# Altium schematic sheet light.SchDoc
size A0; Revision: V 1.0
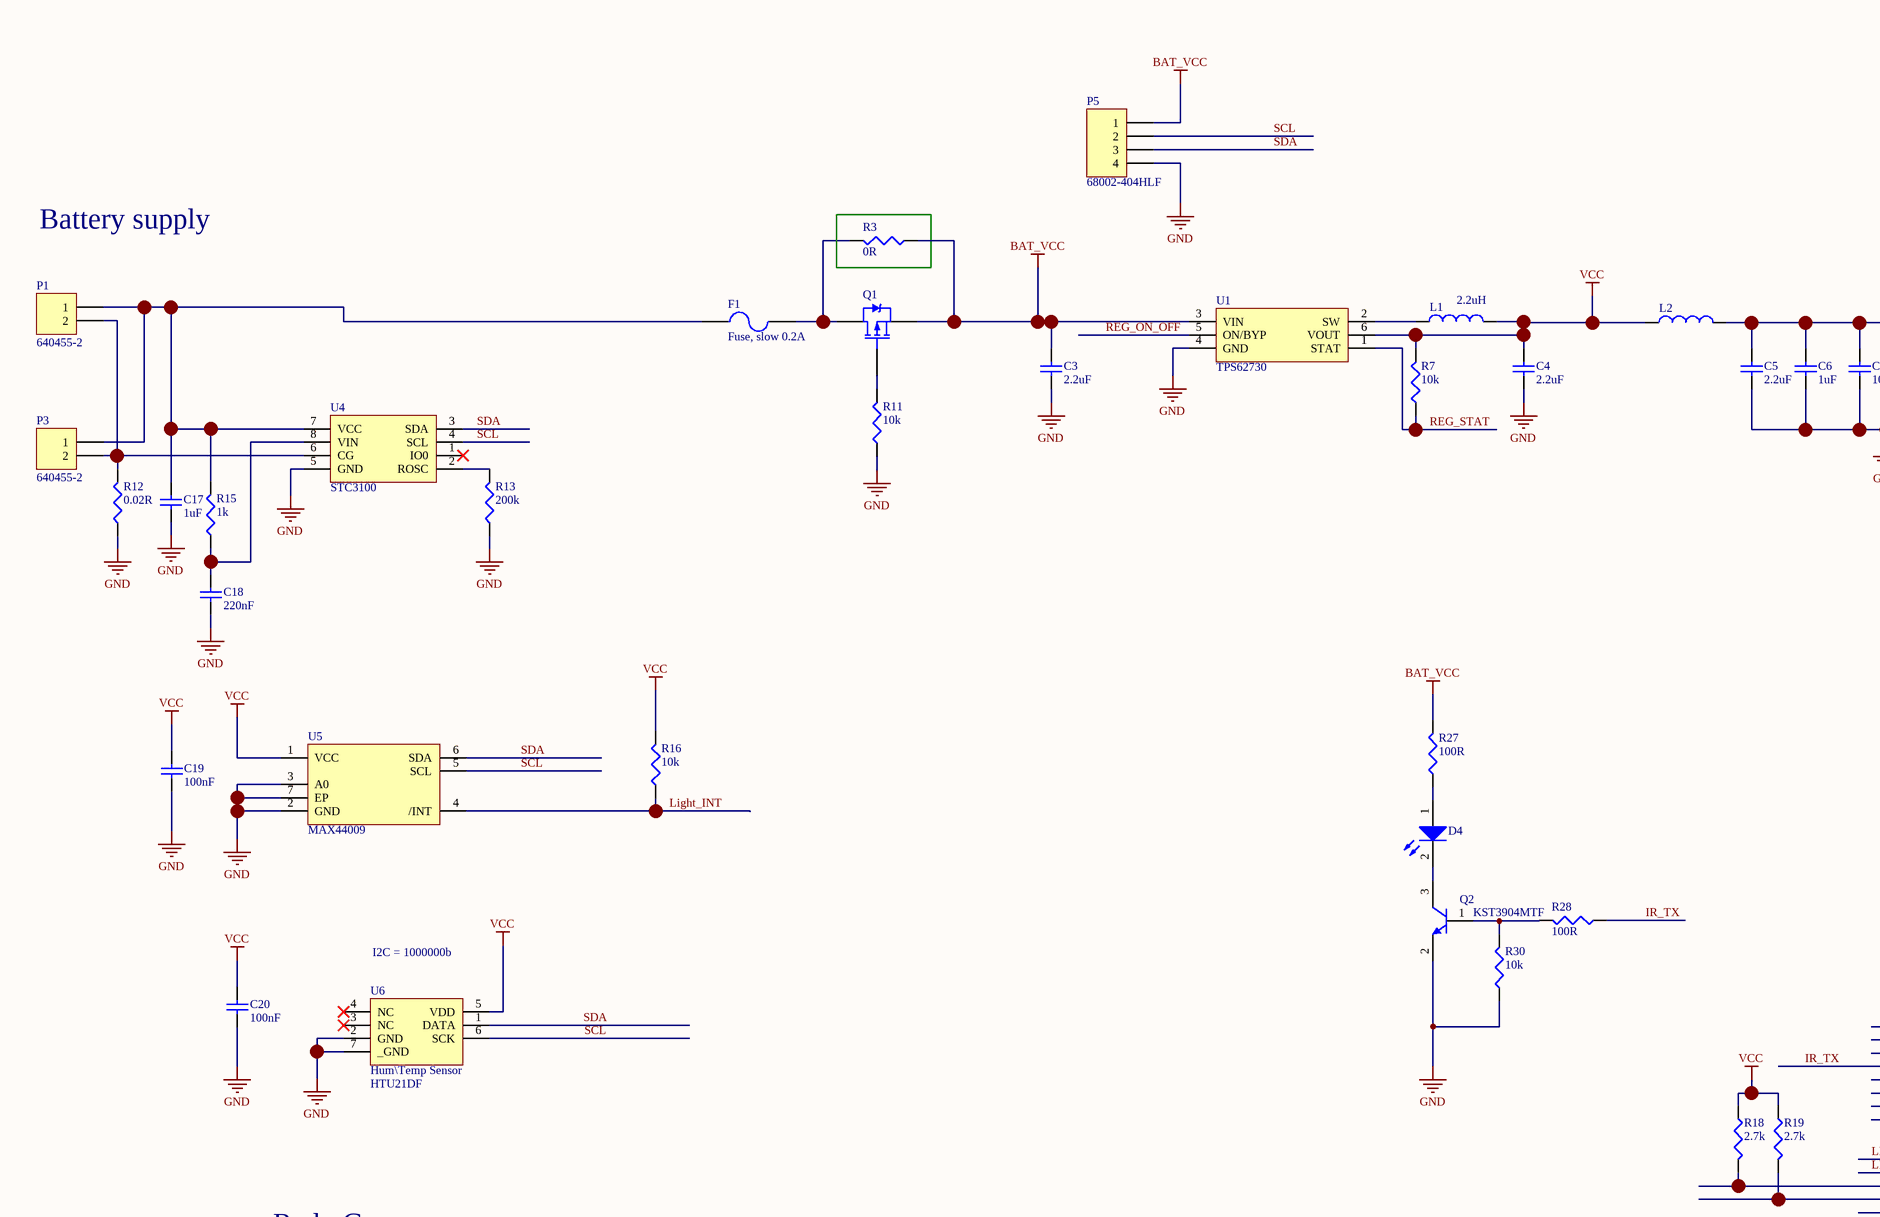
[diagram p0: light.SchDoc, top left]
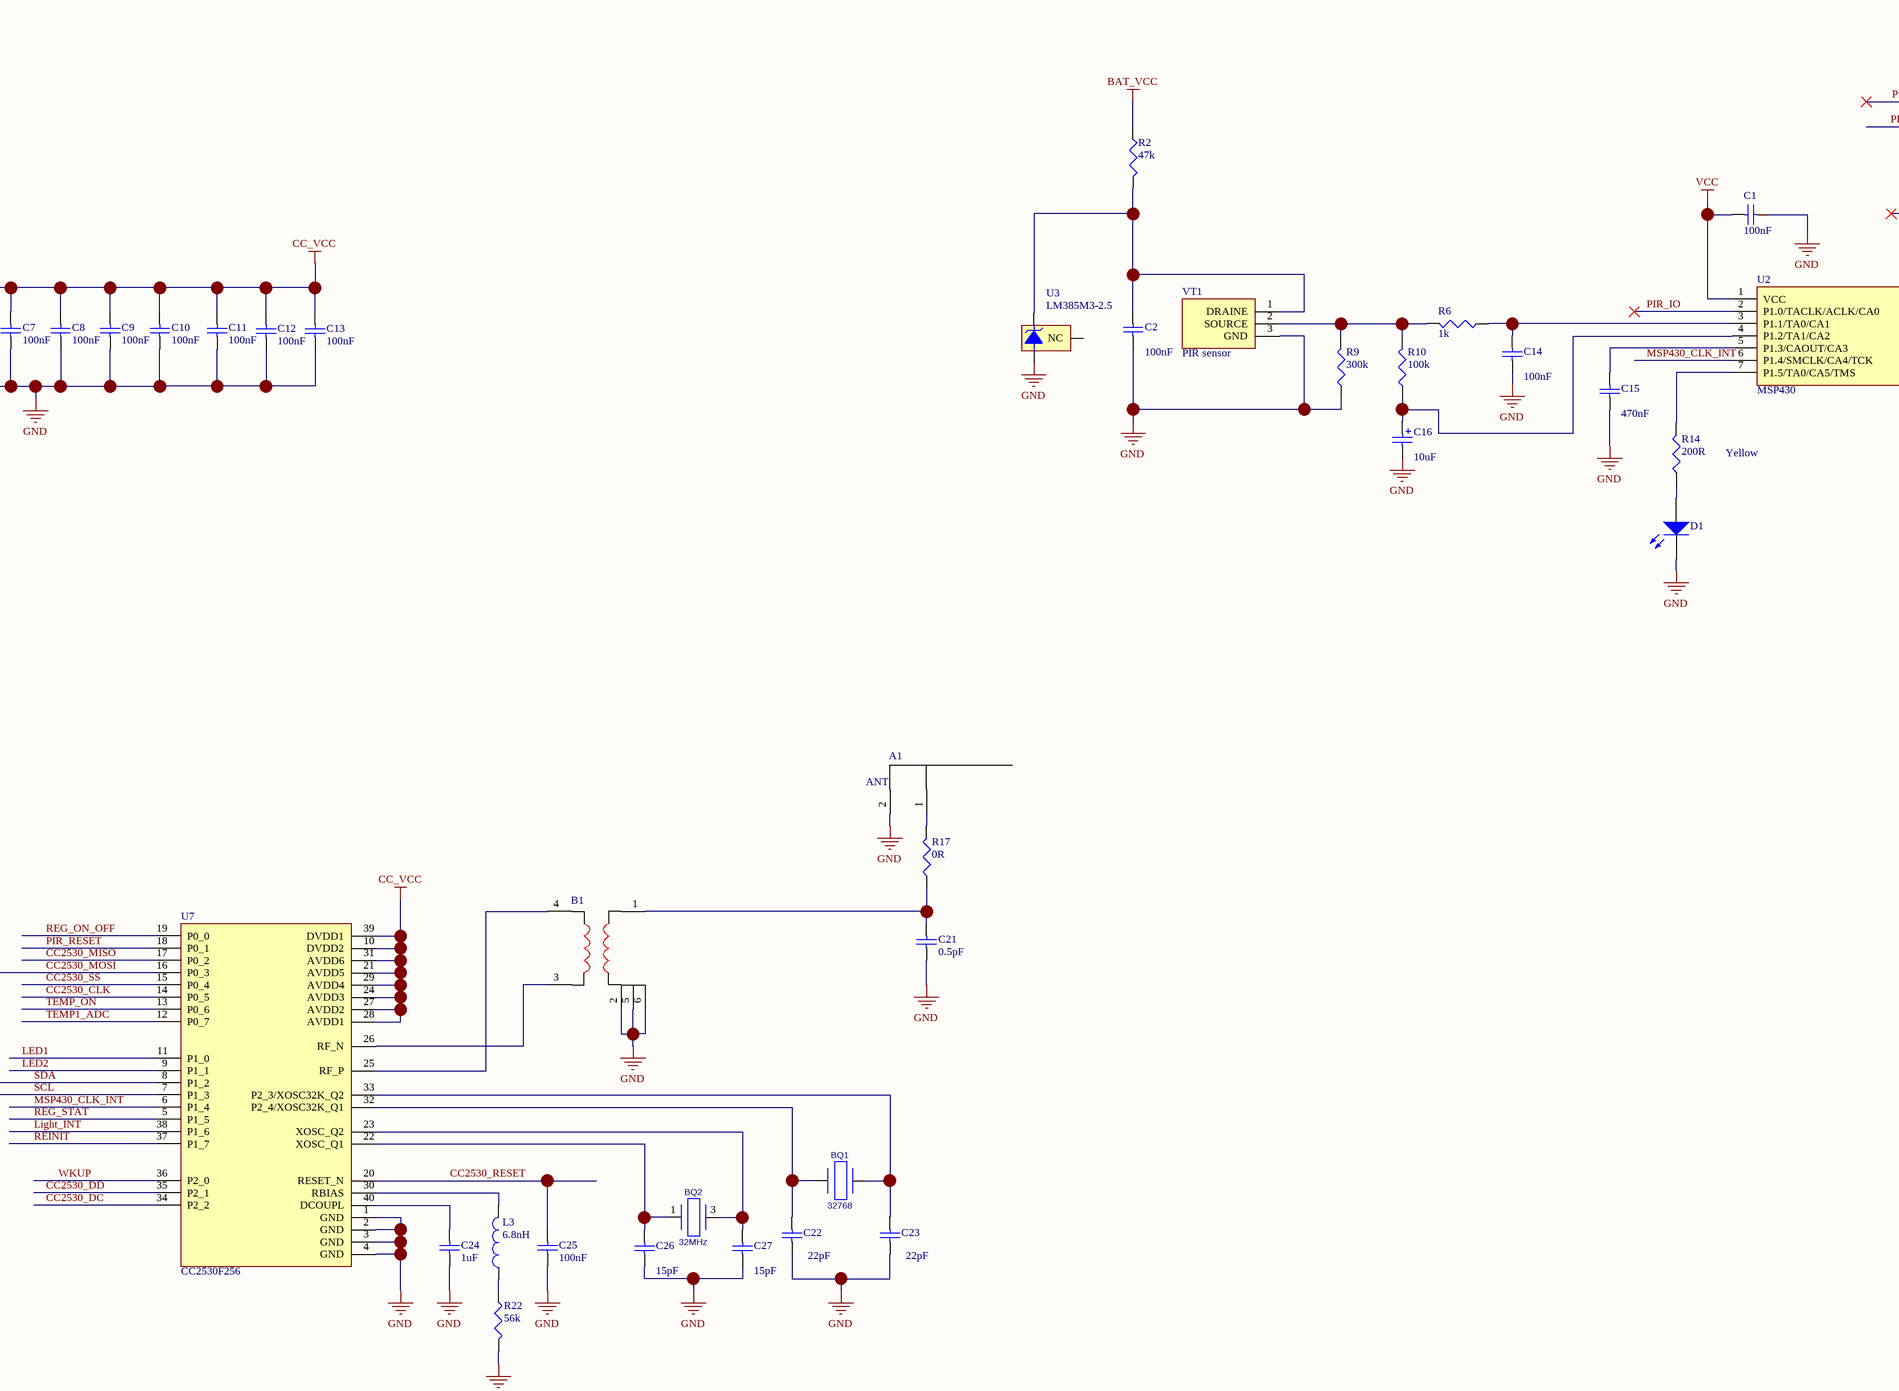
[diagram p1: light.SchDoc, top middle]
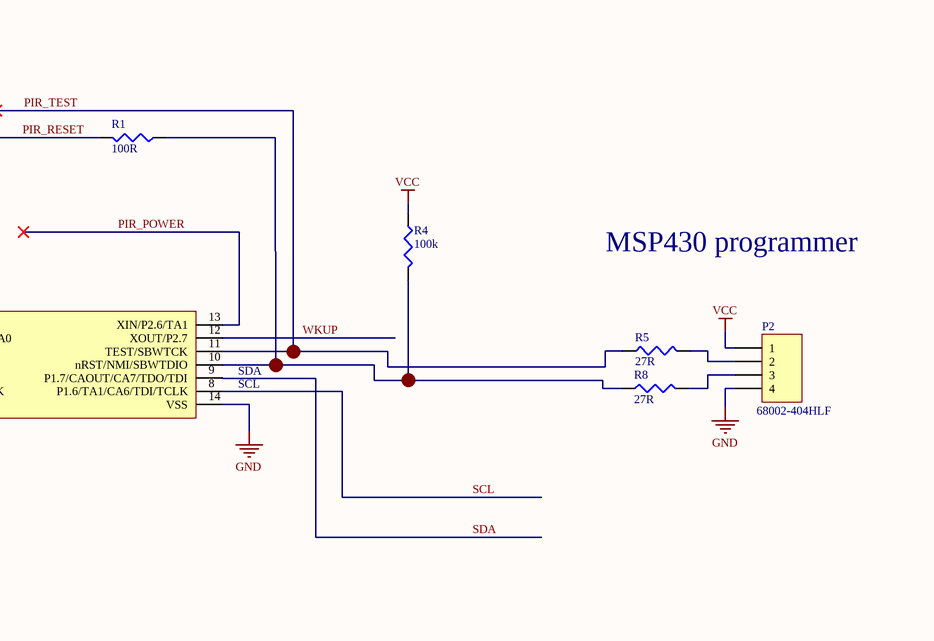
[diagram p2: light.SchDoc, top right]
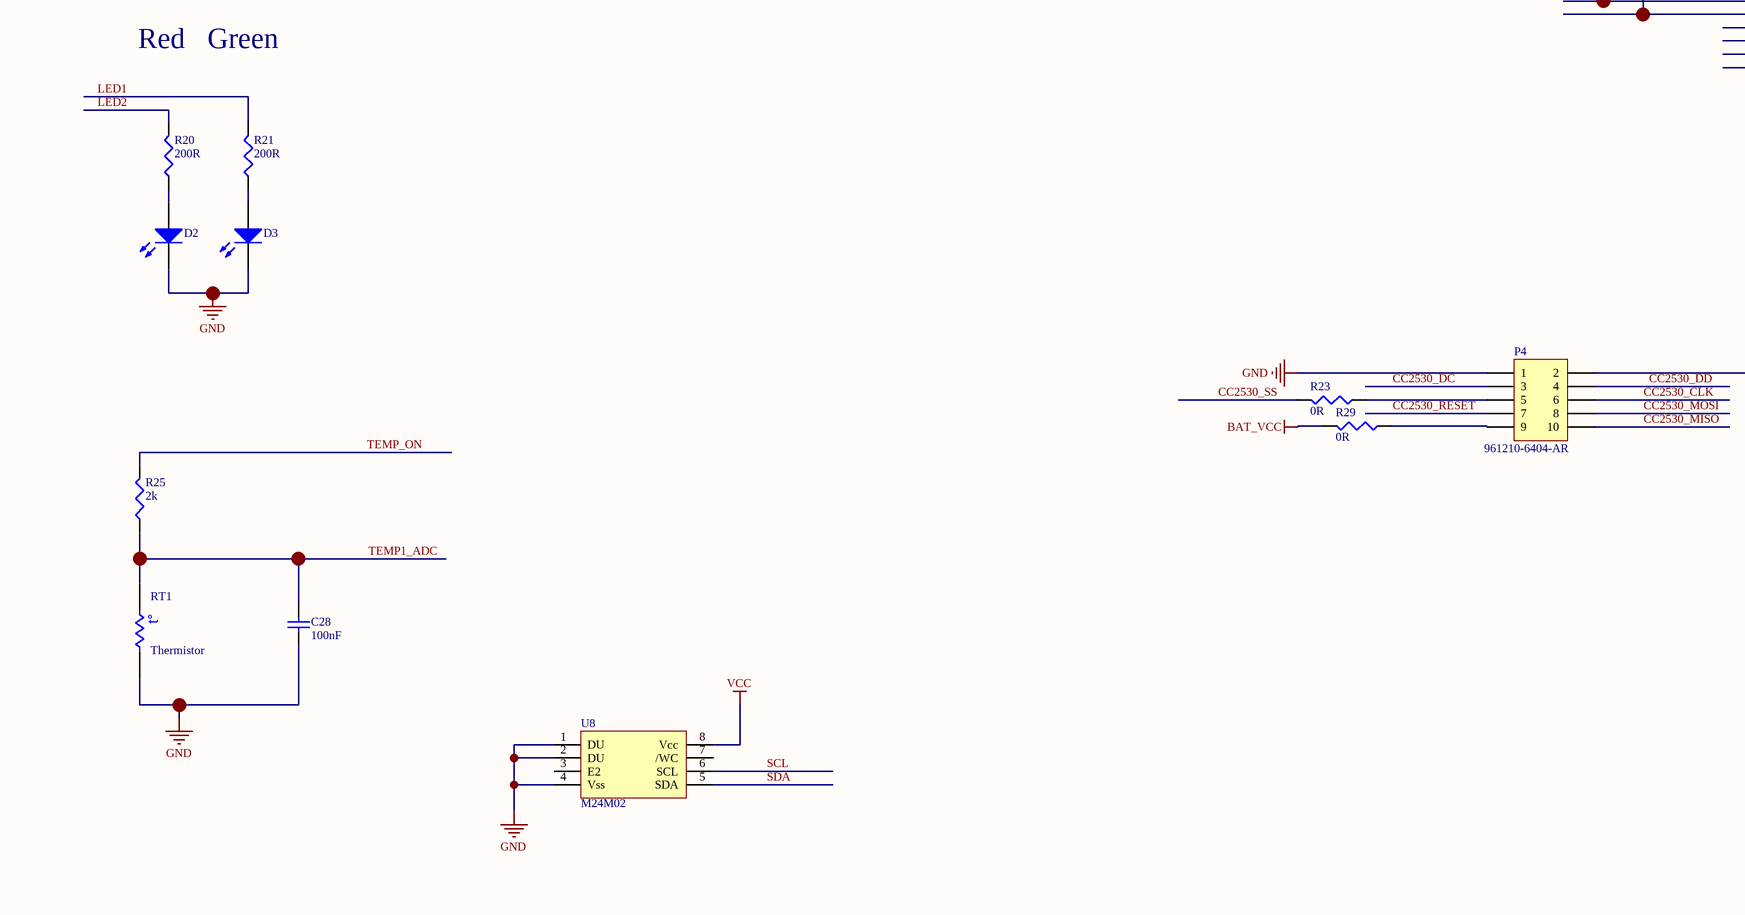
[diagram p3: light.SchDoc, bottom left]
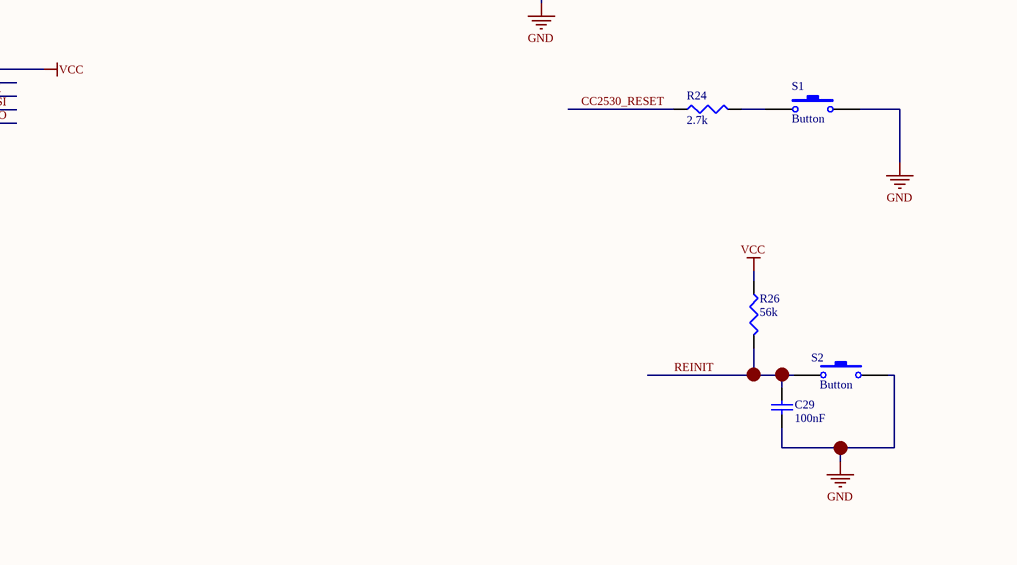
[diagram p4: light.SchDoc, bottom middle]
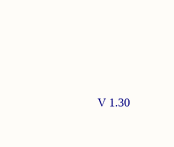
[diagram p5: light.SchDoc, bottom right]

## Parts
A1  ANT  [F ant]
B1  BALUN  [2450BM15A0002]  (value not drawn)
BQ1  value 32768  [FC-12M]  (hidden comment: Crystal)
BQ2  value 32MHz  [403C11A32M00000]  (hidden comment: Crystal)
C1  value 100nF  [0402]  (hidden comment: Capacitor)
C2  value 100nF  [6-0805_L]  (hidden comment: Capacitor)
C3  value 2.2uF  [0402]  (hidden comment: Capacitor)
C4  value 2.2uF  [0402]  (hidden comment: Capacitor)
C5  value 2.2uF  [0402]  (hidden comment: Capacitor)
C6  value 1uF  [0402]  (hidden comment: Capacitor)
C7  value 100nF  [0402]  (hidden comment: Capacitor)
C8  value 100nF  [0402]  (hidden comment: Capacitor)
C9  value 100nF  [0402]  (hidden comment: Capacitor)
C10  value 100nF  [0402]  (hidden comment: Capacitor)
C11  value 100nF  [0402]  (hidden comment: Capacitor)
C12  value 100nF  [0402]  (hidden comment: Capacitor)
C13  value 100nF  [0402]  (hidden comment: Capacitor)
C14  value 100nF  [6-0805_L]  (hidden comment: Capacitor)
C15  value 470nF  [1206]  (hidden comment: Capacitor)
C16  value 10uF  [0603]  (hidden comment: Tantal Cap)
C17  value 1uF  [0402]  (hidden comment: Capacitor)
C18  value 220nF  [0402]  (hidden comment: Capacitor)
C19  value 100nF  [0402]  (hidden comment: Capacitor)
C20  value 100nF  [0402]  (hidden comment: Capacitor)
C21  value 0.5pF  [0402]  (hidden comment: Capacitor)
C22  value 22pF  [0402]  (hidden comment: Capacitor)
C23  value 22pF  [0402]  (hidden comment: Capacitor)
C24  value 1uF  [0402]  (hidden comment: Capacitor)
C25  value 100nF  [0402]  (hidden comment: Capacitor)
C26  value 15pF  [0402]  (hidden comment: Capacitor)
C27  value 15pF  [0402]  (hidden comment: Capacitor)
C28  value 100nF  [0402]  (hidden comment: Capacitor)
C29  value 100nF  [0402]  (hidden comment: Capacitor)
D1  Led  [LED0603]  (value not drawn)
D2  Led  [LED0603]  (value not drawn)
D3  Led  [LED0603]  (value not drawn)
D4  Led  [TSHF5410]  (value not drawn)
F1  Fuse, slow 0.2A  [SF1206S0502]
L1  value 2.2uH  [6-0805_L]  (hidden comment: Inductor)
L2  Inductor  [0402]  (value not drawn)
L3  value 6.8nH  [0402]  (hidden comment: Inductor)
P1  Manufacturer Part Number: 640455-2  [BAT_CON]  (hidden comment: Connector)
P2  Manufacturer Part Number: 68002-404HLF  [HDR1X4]  (hidden comment: Header 4)
P3  Manufacturer Part Number: 640455-2  [BAT_CON]  (hidden comment: Connector)
P4  Manufacturer Part Number: 961210-6404-AR  [HDR2X5]  (hidden comment: *)
P5  Manufacturer Part Number: 68002-404HLF  [HDR1X4]  (hidden comment: Header 4)
Q1  IRLML6302GTRPBF  [SOT-23_N]  (value not drawn)
Q2  KST3904MTF  [SOT-23_N]
R1  value 100R  [0402]  (hidden comment: Resistor)
R2  value 47k  [0603]  (hidden comment: Resistor)
R3  value 0R  [0402]  (hidden comment: Blob)
R4  value 100k  [0603]  (hidden comment: Resistor)
R5  value 27R  [0603]  (hidden comment: Res)
R6  value 1k  [0603]  (hidden comment: Resistor)
R7  value 10k  [0402]  (hidden comment: Resistor)
R8  value 27R  [0603]  (hidden comment: Res)
R9  value 300k  [0603]  (hidden comment: Resistor)
R10  value 100k  [0603]  (hidden comment: Resistor)
R11  value 10k  [0402]  (hidden comment: Resistor)
R12  value 0.02R  [0603]  (hidden comment: Resistor)
R13  value 200k  [6-0805_L]  (hidden comment: Resistor)
R14  value 200R  [0603]  (hidden comment: Resister)
R15  value 1k  [0402]  (hidden comment: Resistor)
R16  value 10k  [0402]  (hidden comment: Resistor)
R17  value 0R  [0402]  (hidden comment: Blob)
R18  value 2.7k  [0402]  (hidden comment: Resistor)
R19  value 2.7k  [0402]  (hidden comment: Resistor)
R20  value 200R  [0603]  (hidden comment: Resister)
R21  value 200R  [0603]  (hidden comment: Resister)
R22  value 56k  [0402]  (hidden comment: Resistor)
R23  value 0R  [0402]  (hidden comment: Blob)
R24  value 2.7k  [0402]  (hidden comment: Resistor)
R25  value 2k  [0603]  (hidden comment: Resistor)
R26  value 56k  [0402]  (hidden comment: Resistor)
R27  value 100R  [0603]  (hidden comment: Resister)
R28  value 100R  [0603]  (hidden comment: Resister)
R29  value 0R  [0402]  (hidden comment: Blob)
R30  value 10k  [0402]  (hidden comment: Resistor)
RT1  Thermistor  [0603]
S1  Button  [B3U-3000P]
S2  Button  [TL3330]
U1  TPS62730  [6SON]
U2  MSP430  [TSOP14]
U3  LM385M3-2.5  [SOT23]
U4  STC3100  [DFN8]
U5  MAX44009  [QFN127P600-8N]
U6  Hum\Temp Sensor  Manufacturer Part Number: HTU21DF  [QFN6]
U7  CC2530F256  [QFN40]
U8  M24M02  [SO8]
VT1  PIR sensor  [TO5]

## Nets
BAT_VCC: C3.1 P5.1 Q1.2(S) R2.2 R3.1 R27.1 R29.2 U1.3(VIN)
CC_VCC: C5.1 C6.1 C7.1 C8.1 C9.1 C10.1 C11.1 C12.1 C13.1 L2.2 U7.10(DVDD2) U7.21(AVDD5) U7.24(AVDD3) U7.27(AVDD2) U7.28(AVDD1) U7.29(AVDD4) U7.31(AVDD6) U7.39(DVDD1)
GND: A1.2 B1.2 B1.5 B1.6 C1.2 C2.1 C3.2 C4.2 C5.2 C6.2 C7.2 C8.2 C9.2 C10.2 C11.2 C12.2 C13.2 C14.1 C15.1 C16.2 C17.2 C18.2 C19.2 C20.2 C21.2 C22.1 C23.1 C24.2 C25.2 C26.1 C27.1 C28.2 C29.2 D1.2(K) D2.2(K) D3.2(K) P2.4 P4.1 P5.4 Q2.2(E) R9.1 R11.2 R12.2 R13.2 R22.2 R30.2 RT1.2 S1.2 S2.2 U1.4(GND) U2.14(VSS) U3.2(-V) U4.5(GND) U5.2(GND) U5.3(A0) U5.7(EP) U6.2(GND) U6.7(_GND) U7.1(GND) U7.2(GND) U7.3(GND) U7.4(GND) U8.1(DU) U8.2(DU) U8.4(Vss) VT1.3(GND)
VCC: C1.1 C4.1 C19.1 C20.1 L1.2 L2.1 P2.1 P4.2 R4.1 R7.1 R16.1 R18.2 R19.2 R26.1 U1.6(VOUT) U2.1(VCC) U5.1(VCC) U6.5(VDD) U8.8(Vcc)
CC2530_CLK: P4.6 U7.14(P0_5)
CC2530_DC: P4.3 U7.34(P2_2)
CC2530_DD: P4.4 U7.35(P2_1)
CC2530_MISO: P4.10 U7.17(P0_2)
CC2530_MOSI: P4.8 R28.2 U7.16(P0_3)  [also labelled IR_TX]
CC2530_RESET: C25.1 P4.7 R24.2 U7.20(RESET_N)
CC2530_SS: R23.2 U7.15(P0_4)
LED1: R21.1 U7.11(P1_0)
LED2: R20.1 U7.9(P1_1)
Light_INT: R16.2 U5.4(/INT) U7.38(P1_6)
MSP430_CLK_INT: U2.6(P1.4/SMCLK/CA4/TCK) U7.6(P1_4)
PIR_IO: U2.2(P1.0/TACLK/ACLK/CA0)
PIR_POWER: U2.13(XIN/P2.6/TA1)
PIR_RESET: R1.2 U7.18(P0_1)
PIR_TEST: R5.1 U2.11(TEST/SBWTCK)
REG_ON_OFF: U1.5(ON/BYP) U7.19(P0_0)
REG_STAT: R7.2 U1.1(STAT) U7.5(P1_5)
REINIT: C29.1 R26.2 S2.1 U7.37(P1_7)
SCL: P5.2 R19.1 U2.8(P1.6/TA1/CA6/TDI/TCLK) U4.4(SCL) U5.5(SCL) U6.6(SCK) U7.7(P1_3) U8.6(SCL)
SDA: P5.3 R18.1 U2.9(P1.7/CAOUT/CA7/TDO/TDI) U4.3(SDA) U5.6(SDA) U6.1(DATA) U7.8(P1_2) U8.5(SDA)
TEMP1_ADC: C28.1 R25.1 RT1.1 U7.12(P0_7)
TEMP_ON: R25.2 U7.13(P0_6)
WKUP: U2.12(XOUT/P2.7) U7.36(P2_0)
NetA1_1: A1.1 R17.2
NetB1_1: B1.1 C21.1 R17.1
NetB1_3: B1.3 U7.26(RF_N)
NetB1_4: B1.4 U7.25(RF_P)
NetBQ1_1: BQ1.1 C22.2 U7.32(P2_4/XOSC32K_Q1)
NetBQ1_2: BQ1.2 C23.2 U7.33(P2_3/XOSC32K_Q2)
NetBQ2_1: BQ2.1 C26.2 U7.22(XOSC_Q1)
NetBQ2_3: BQ2.3 C27.2 U7.23(XOSC_Q2)
NetC2_2: C2.2 R2.1 U3.1(+V) VT1.1(DRAINE)
NetC14_2: C14.2 R6.1 U2.3(P1.1/TA0/CA1)
NetC15_2: C15.2 U2.5(P1.3/CAOUT/CA3)
NetC16_1: C16.1 R10.1 U2.4(P1.2/TA1/CA2)
NetC17_1: C17.1 F1.1 P1.1 P3.1 R15.1 U4.7(VCC)
NetC18_1: C18.1 R15.2 U4.8(VIN)
NetC24_1: C24.1 U7.40(DCOUPL)
NetD1_1: D1.1(A) R14.2
NetD2_1: D2.1(A) R20.2
NetD3_1: D3.1(A) R21.2
NetD4_1: D4.1(A) R27.2
NetD4_2: D4.2(K) Q2.3(C)
NetF1_2: F1.2 Q1.3(D) R3.2
NetL1_1: L1.1 U1.2(SW)
NetL3_1: L3.1 R22.1
NetL3_2: L3.2 U7.30(RBIAS)
NetP1_2: P1.2 P3.2 R12.1 U4.6(CG)
NetP2_2: P2.2 R5.2
NetP2_3: P2.3 R8.2
NetP4_5: P4.5 R23.1
NetP4_9: P4.9 R29.1
NetQ1_1: Q1.1(G) R11.1
NetQ2_1: Q2.1(B) R28.1 R30.1
NetR1_1: R1.1 R4.2 R8.1 U2.10(nRST/NMI/SBWTDIO)
NetR6_2: R6.2 R9.2 R10.2 VT1.2(SOURCE)
NetR13_1: R13.1 U4.2(ROSC)
NetR14_1: R14.1 U2.7(P1.5/TA0/CA5/TMS)
NetR24_1: R24.1 S1.1

Not connected (* = marked no-connect by the designer): U3 3(NC); U4 1(IO0)*; U6 3(NC)* 4(NC)*; U8 3(E2) 7(/WC)

## Notes on the sheet
- Battery supply
- MSP430 programmer
- (near U2) SDA
- (near U2) SCL
- Yellow
- (near U6) I2C = 1000000b
- Red   Green
- V 1.30
- (in symbol Res Thermal) t°

## Library data of the parts
A1 = ANT: Inverted-F Antenna; Manufacturer Part Number: PCB ANT; Mount: 1; Manufacturer: *
B1 = BALUN: BALUN JTI MATCHED ZIGBEE; Manufacturer Part Number: 2450BM15A0002E; Manufacturer: Johanson Technology Inc; Mount: 1
BQ1 = 6LC:308C: CRYSTAL 32.768KHZ 12.5PF SMD; Manufacturer Part Number: FC-12M 32.7680KA-A3; Manufacturer: EPSON; Mount: 1
BQ2 = HC-49SMD: CRYSTAL 32MHZ 10PF SMD; Manufacturer: CTS-Frequency Controls; Manufacturer Part Number: 403C11A32M00000; Mount: 1
C1 C7-C13 C19 C20 C25 C28 C29 = Cap: CAP CER 0.1UF 10V 20% X5R 0402; Manufacturer Part Number: CL05A104MP5NNNC; Manufacturer: Samsung Electro-Mechanics America, Inc; Mount: 1
C2 C14 = Cap: CAP FILM 0.1UF 16VDC 0805; Manufacturer Part Number: ECP-U1C104MA5; Manufacturer: Panasonic Electronic Components; Mount: 1
C3-C5 = Cap: CAP CER 2.2UF 6.3V 20% X5R 0402; Manufacturer Part Number: CL05A225MQ5NNNC; Manufacturer: Samsung Electro-Mechanics America, Inc; Mount: 1
C6 C17 C24 = Cap: CAP CER 1UF 6.3V 10% X5R 0402; Manufacturer Part Number: GRM155R60J105KE19D; Manufacturer: Murata Electronics North America; Mount: 1
C15 = Cap: CAP FILM 0.47UF 16VDC 1206; Manufacturer Part Number: ECP-U1C474MA5; Manufacturer: Panasonic Electronic Components; Mount: 1
C16 = Cap Pol2: CAP CER 10UF 6.3V 20% X5R 0603; Manufacturer Part Number: GRM188R60J106ME47D; Manufacturer: Murata Electronics North America; Mount: 1
C18 = Cap: CAP CER 0.22UF 10V 10% X5R 0402; Manufacturer Part Number: CL05A224KP5NNNC; Manufacturer: Samsung Electro-Mechanics America, Inc; Mount: 1
C21 = Cap: CAP CER 0.5PF 50V NP0 0402; Manufacturer Part Number: GRM1555C1HR50CA01D; Manufacturer: Murata Electronics North America; Mount: 1
C22 C23 = Cap: CAP CER 22PF 50V 5% NP0 0402; Manufacturer Part Number: GRM1555C1H220JA01D; Manufacturer: Murata Electronics North America; Mount: 1
C26 C27 = Cap: CAP CER 15PF 50V 5% NP0 0402; Manufacturer Part Number: GRM1555C1H150JA01D; Manufacturer: Murata Electronics North America; Mount: 1
D1 = LED0: LED YELLOW ROUND CLEAR SMD; Manufacturer Part Number: APTD1608SYCK; Manufacturer: Kingbright Company LLC; Mount: 0
D2 = LED0: LED RED ROUND CLEAR SMD; Manufacturer Part Number: APTD1608SURCK; Manufacturer: Kingbright Company LLC; Mount: 1
D3 = LED0: LED GREEN CLEAR THIN 0603 SMD; Manufacturer Part Number: LTST-C191KGKT; Manufacturer: Lite-On Inc; Mount: 1
D4 = LED0: EMITTER IR 5MM HI EFF 940NM; Manufacturer Part Number: TSAL6400; Manufacturer: Vishay Semiconductor Opto Division; Mount: 1
F1 = Fuse 2: FUSE .200A 125V FAST 1206; Manufacturer Part Number: 0466.200NR; Manufacturer: Littelfuse Inc; Mount: 1
L1 = Inductor: INDUCTOR 2.2UH 0805; Manufacturer Part Number: LQM21PN2R2NGCD; Manufacturer: Murata Electronics North America; Mount: 1
L2 = Inductor: FILTER CHIP 1000 OHM 250MA 0402; Manufacturer Part Number: BLM15HG102SN1D; Manufacturer: Murata Electronics North America; Mount: 1
L3 = Inductor: INDUCTOR 6.8NH 300MA 0402; Manufacturer Part Number: LQG15HS6N8J02D; Manufacturer: Murata Electronics North America; Mount: 1
P1 P3 = Header 2: CONN HEADER VERT 2POS .100 TIN; Manufacturer: TE Connectivity; Mount: 1
P2 P5 = Header 4: CONN HEADER 4POS .100 STR TIN; Manufacturer: FCI
  P2: Mount: 1
  P5: Mount: 0
P4 = Header 5X2: CONN HEADER VERT DUAL 10POS GOLD; Manufacturer: 3M; Mount: 1
Q1 = IRLML6302: HEXFET Power MOSFET; Manufacturer: International Rectifier; Published: 8-Jun-2000; LatestRevisionDate: 20-Nov-2009; LatestRevisionNote: IPC-7351 Footprint Added.; DatasheetVersion: Aug-1997; PackageReference: SOT-23; Publisher: Altium Limited; PackageDescription: 3-Pin SOT-23 Package 0.95 mm Pitch, 2.3 mm Lead Span; ComponentLink1Description: Manufacturer Link; ComponentLink1URL: http://www.irf.com/; ComponentLink2Description: Datasheet; ComponentLink2URL: http://www.irf.com/product-info/datasheets/data/irlml6302.pdf; Manufacturer Part Number: IRLML6302GTRPBF; Mount: 1
Q2 = 2N3904: TRANSISTOR NPN 40V 200MA SOT-23; Manufacturer: Fairchild Semiconductor; Manufacturer Part Number: KST3904MTF; Mount: 1
R1 = Res3: RES 100 OHM 1/10W 5% 0402 SMD; Manufacturer Part Number: ERJ-2GEJ101X; Manufacturer: Panasonic Electronic Components; Mount: 1
R2 = Res3: RES 47K OHM 1/10W 5% 0603 SMD; Manufacturer Part Number: RC0603JR-0747KL; Manufacturer: Yageo; Mount: 1
R3 R17 R23 R29 = Res3: RES 0.0 OHM 1/10W JUMP 0402 SMD; Manufacturer Part Number: ERJ-2GE0R00X; Manufacturer: Panasonic Electronic Components
  R3 R29: Mount: 0
  R17 R23: Mount: 1
R4 R10 = Res3: RES 100K OHM 1/10W 5% 0603 SMD; Manufacturer Part Number: RC0603JR-07100KL; Manufacturer: Yageo; Mount: 1
R5 R8 = Res3: RES 27 OHM 1/10W 5% 0603; Manufacturer Part Number: RC1608J270CS; Manufacturer: Samsung Electro-Mechanics America, Inc; Mount: 1
R6 = Res3: RES 1.0K OHM 1/10W 5% 0603 SMD; Manufacturer Part Number: RC0603JR-071KL; Manufacturer: Yageo; Mount: 1
R7 R11 R16 R30 = Res3: RES 10K OHM 1/10W 5% 0402 SMD; Manufacturer Part Number: ERJ-2GEJ103X; Manufacturer: Panasonic Electronic Components; Mount: 1
R9 = Res3: RES 300K OHM 1/10W 5% 0603 SMD; Manufacturer Part Number: RC0603JR-07300KL; Manufacturer: Yageo; Mount: 1
R12 = Res3: RES 0.02 OHM 1/4W 1% 0603; Manufacturer Part Number: RU1608FR020CS; Manufacturer: Samsung Electro-Mechanics America, Inc; Mount: 1
R13 = Res3: RES 200K OHM 1/8W .1% 0805 SMD; Manufacturer Part Number: ERA-6AEB204V; Manufacturer: Panasonic Electronic Components; Mount: 1
R14 R20 R21 = Res3: RES 200 OHM 1/10W 5% 0603 SMD; Manufacturer Part Number: RC0603JR-07200RL; Manufacturer: Yageo
  R14: Mount: 0
  R20 R21: Mount: 1
R15 = Res3: RES 1K OHM 1/10W 1% 0402 SMD; Manufacturer Part Number: ERJ-2RKF1001X; Manufacturer: Panasonic Electronic Components; Mount: 1
R18 R19 R24 = Res3: RES 2.7K OHM 1/10W 5% 0402 SMD; Manufacturer Part Number: ERJ-2GEJ272X; Manufacturer: Panasonic Electronic Components; Mount: 1
R22 R26 = Res3: RES 56K OHM 1/10W 1% 0402 SMD; Manufacturer Part Number: ERJ-2RKF5602X; Manufacturer: Panasonic Electronic Components; Mount: 1
R25 = Res3: RES 2.0K OHM 1/10W 5% 0603 SMD; Manufacturer Part Number: RC0603JR-072KL; Manufacturer: Yageo; Mount: 1
R27 R28 = Res3: RES 100 OHM 1/10W 5% 0603 SMD; Manufacturer Part Number: ERJ-3GEYJ101V; Manufacturer: Panasonic Electronic Components; Mount: 1
RT1 = Res Thermal: THERMISTOR NTC 1K OHM 5% 0603; Manufacturer Part Number: ERT-J1VT102J; Manufacturer: Panasonic Electronic Components; Mount: 1
S1 = SW-PB: SWITCH TACTILE; Manufacturer Part Number: B3U-1000P; Manufacturer: Omron Electronics Inc-EMC Div; Mount: 1
S2 = SW-PB: SWITCH TACTILE SPST-NO 0.05A 12V; Manufacturer Part Number: TL3330AF260QG; Manufacturer: E-Switch; Mount: 1
U1 = TPS62730: IC DCDC CONV STP-DN SYNC LP 6SON; Manufacturer Part Number: TPS62730DRYT; Manufacturer: Texas Instruments; Mount: 1
U2 = MSP430F20x3: MIXED SIGNAL MICROCONTROLLER; Manufacturer Part Number: MSP430F2013IPW; Manufacturer: Texas Instruments; datasheet: http://www.ti.com/lit/ds/symlink/msp430f2013.pdf; Mount: 1
U3 = LM385M3-2.5: Micropower Voltage Reference Diode, 3-pin SOT-23; Manufacturer: National Semiconductor; Manufacturer Part Number: LM385M3-2.5/NOPB; PackageTopMarking: R12*XTT; PowerWise: N; CompType: Voltage Reference IC; Published: 4-Dec-2008; DatasheetVersion: Jan-2008; PackageVersion: revB, Mar-2003; PackageReference: MF03A; Publisher: Altium Limited; PackageDescription: Molded SOT-23, .115 x .051 x .037in Body, 3 Lead, .075 in Pitch; Supplier 1: Farnell; Supplier Part Number 1: 9778160RL; Supplier 2: Farnell; Supplier Part Number 2: 9778160; PartNumber: LM385M3-2.5; RoHS: N; PinCount: 3; ComponentLink1Description: LM385-2.5 Datasheet; ComponentLink1URL: http://www.national.com/ds/LM/LM385-2.5.pdf; ComponentLink2Description: LM385-2.5 Web Page; ComponentLink2URL: http://www.national.com/pf/LM/LM385-2.5.html; ComponentLink3Description: MF03A Package Page; ComponentLink3URL: http://www.national.com/packaging/folders/mf03a.html; Mount: 1
U4 = STC3100: IC BATTERY MON W/GAUGE 8-DFN; Manufacturer Part Number: STC3100IQT; Manufacturer: STMicroelectronics; Mount: 1
U5 = MAX44009: SENSOR AMBIENT LIGHT 6UTDFN; Manufacturer Part Number: MAX44009EDT+T; Manufacturer: Maxim Integrated; Mount: 1
U6 = HTU21D: Miniature Relative Humidity and Temperature Sensor; Manufacturer: Measurement Specialties; datasheet: http://www.meas-spec.com/downloads/HTU21D.pdf; Mount: 1
U7 = CC2530F256: IC SOC IEEE 802.15.4/ZIG 40VQFN; Manufacturer Part Number: CC2530F256RHAT; Manufacturer: Texas Instruments; Mount: 1
U8 = M24M02: IC EEPROM 2MBIT 1MHZ 8SO; Manufacturer Part Number: M24M02-DRMN6TP; Manufacturer: STMicroelectronics; Mount: 1
VT1 = PIR_Sensor: Manufacturer Part Number: C174; Manufacturer: Kube; Mount: 1